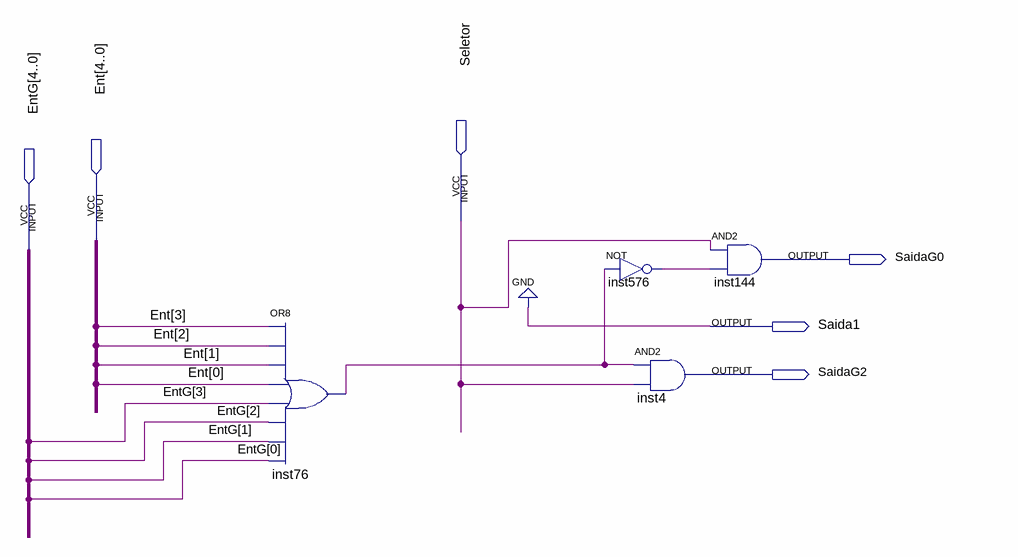
[diagram p0: schematic sheet]
// Quartus schematic Comp01.bdf as structural Verilog: 4 symbols, 6 pins
module Comp01 (
  input  Seletor,
  input  [4:0] Ent,
  input  [4:0] EntG,
  output SaidaG0,
  output Saida1,
  output SaidaG2
);

  wire inst76_out, inst576_out;

  or inst76 (inst76_out, Ent[3], Ent[2], Ent[1], Ent[0], EntG[3], EntG[2], EntG[1], EntG[0]);
  not inst576 (inst576_out, inst76_out);
  and inst4 (SaidaG2, inst76_out, Seletor);
  and inst144 (SaidaG0, Seletor, inst576_out);

  assign Saida1 = 1'b0;
endmodule
